# EAGLE schematic R3D2_v2 (EAGLE 6.4)
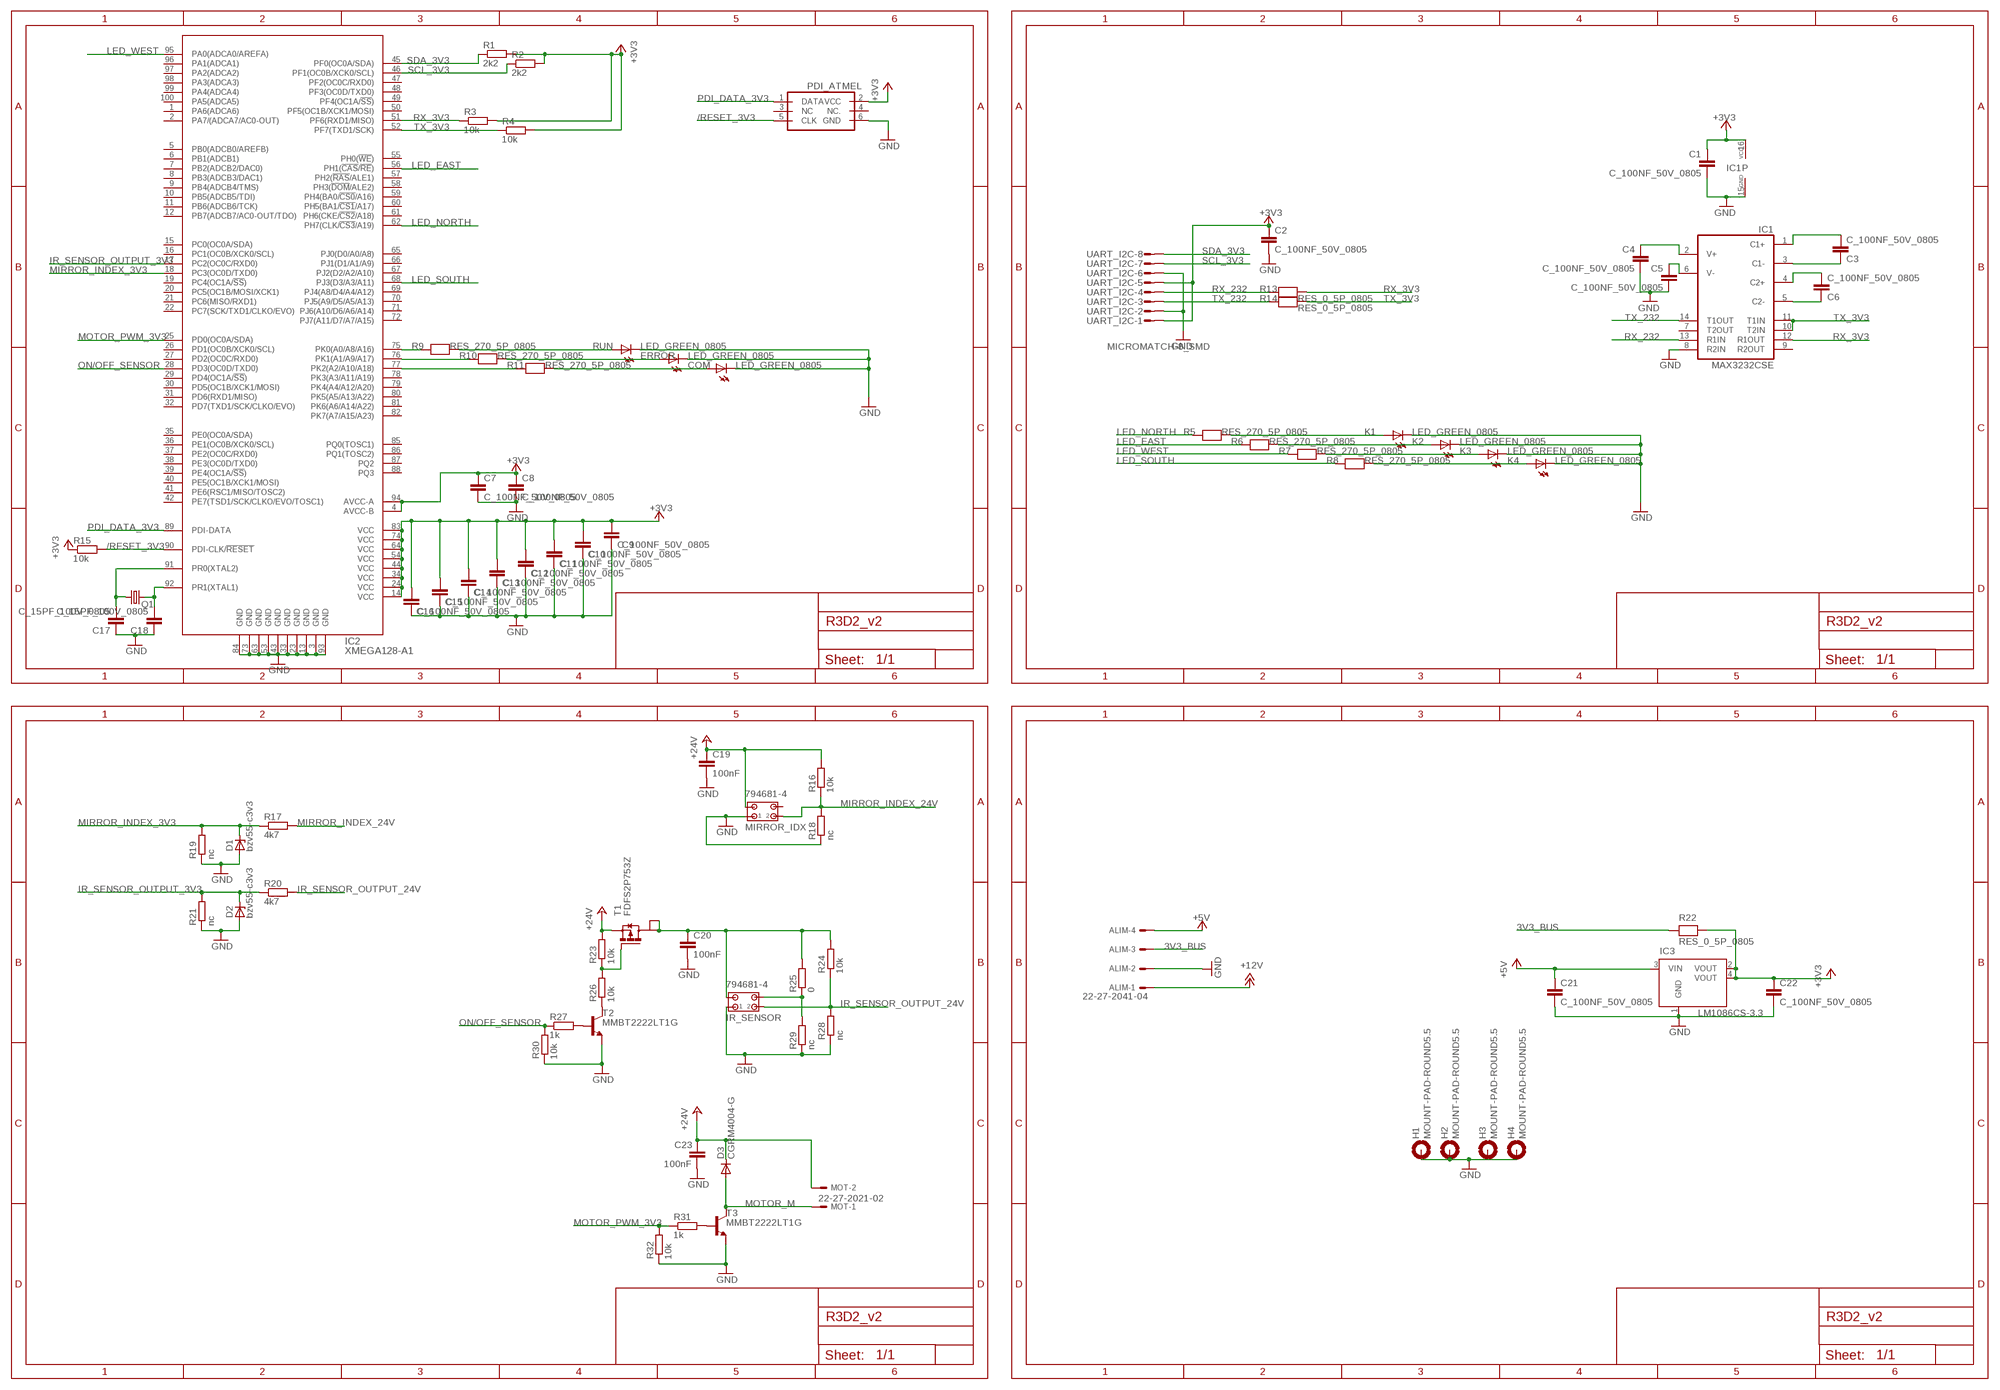
[diagram p0: schematic, sheet 1]

## Parts
ALIM  22-27-2041-04  [6410-04]
C1  C_100NF_50V_0805  [C0805]
C2  C_100NF_50V_0805  [C0805]
C3  C_100NF_50V_0805  [C0805]
C4  C_100NF_50V_0805  [C0805]
C5  C_100NF_50V_0805  [C0805]
C6  C_100NF_50V_0805  [C0805]
C7  C_100NF_50V_0805  [C0805]
C8  C_100NF_50V_0805  [C0805]
C9  C_100NF_50V_0805  [C0805]
C10  C_100NF_50V_0805  [C0805]
C11  C_100NF_50V_0805  [C0805]
C12  C_100NF_50V_0805  [C0805]
C13  C_100NF_50V_0805  [C0805]
C14  C_100NF_50V_0805  [C0805]
C15  C_100NF_50V_0805  [C0805]
C16  C_100NF_50V_0805  [C0805]
C17  C_15PF_100V_0805  [C0805]
C18  C_15PF_100V_0805  [C0805]
C19  100nF  C-EUC0805  [C0805]
C20  100nF  C-EUC0603  [C0603]
C21  C_100NF_50V_0805  [C0805]
C22  C_100NF_50V_0805  [C0805]
C23  100nF  C-EUC0805  [C0805]
COM  LED_GREEN_0805  [CHIP-LED0805]
D1  bzv55-c3v3  ZENER-DIODESOD80C  [SOD80C]
D2  bzv55-c3v3  ZENER-DIODESOD80C  [SOD80C]
D3  CGRM4004-G  [SOD-123_MINI-SMA]
ERROR  LED_GREEN_0805  [CHIP-LED0805]
H1  MOUNT-PAD-ROUND5.5  [5,5-PAD]
H2  MOUNT-PAD-ROUND5.5  [5,5-PAD]
H3  MOUNT-PAD-ROUND5.5  [5,5-PAD]
H4  MOUNT-PAD-ROUND5.5  [5,5-PAD]
IC1  MAX3232CSE  [SO16]
IC2  XMEGA128-A1  XMEGA-A1TQFP  [TQFP100]
IC3  LM1086CS-3.3  [TO263]
IR_SENSOR  794681-4  [794681-4]
K1  LED_GREEN_0805  [CHIP-LED0805]
K2  LED_GREEN_0805  [CHIP-LED0805]
K3  LED_GREEN_0805  [CHIP-LED0805]
K4  LED_GREEN_0805  [CHIP-LED0805]
MIRROR_IDX  794681-4  [794681-4]
MOT  22-27-2021-02  [6410-02]
PDI_ATMEL  PDI_ATMEL  [ML6]
Q1  CRYSTAL_16MHZ_HC49UP  [HC49UP]
R1  2k2  R-EU_R0603  [R0603]
R2  2k2  R-EU_R0603  [R0603]
R3  10k  R-EU_R0603  [R0603]
R4  10k  R-EU_R0603  [R0603]
R5  RES_270_5P_0805  [R0805]
R6  RES_270_5P_0805  [R0805]
R7  RES_270_5P_0805  [R0805]
R8  RES_270_5P_0805  [R0805]
R9  RES_270_5P_0805  [R0805]
R10  RES_270_5P_0805  [R0805]
R11  RES_270_5P_0805  [R0805]
R13  RES_0_5P_0805  [R0805]
R14  RES_0_5P_0805  [R0805]
R15  10k  R-EU_R0603  [R0603]
R16  10k  R-EU_R0603  [R0603]
R17  4k7  R-EU_R0805  [R0805]
R18  nc  R-EU_R0805  [R0805]
R19  nc  R-EU_R0603  [R0603]
R20  4k7  R-EU_R0805  [R0805]
R21  nc  R-EU_R0603  [R0603]
R22  RES_0_5P_0805  [R0805]
R23  10k  R-EU_R0603  [R0603]
R24  10k  R-EU_R0603  [R0603]
R25  0  R-EU_R0603  [R0603]
R26  10k  R-EU_R0603  [R0603]
R27  1k  R-EU_R0603  [R0603]
R28  nc  R-EU_R0603  [R0603]
R29  nc  R-EU_R0603  [R0603]
R30  10k  R-EU_R0603  [R0603]
R31  1k  R-EU_R0603  [R0603]
R32  10k  R-EU_R0603  [R0603]
RUN  LED_GREEN_0805  [CHIP-LED0805]
T1  FDFS2P753Z  [SO8]
T2  MMBT2222LT1G  MMBT2222ALT1-NPN-SOT23-BEC  [SOT23-BEC]
T3  MMBT2222LT1G  MMBT2222ALT1-NPN-SOT23-BEC  [SOT23-BEC]
UART_I2C  MICROMATCH-8_SMD  [MICROMATCH-8_SMD]

## Nets
3V3_BUS: ALIM.3 R22.1
+3V3: C1.1 C2.1 C7.1 C8.1 C9.1 C10.1 C11.1 C12.1 C13.1 C14.1 C15.1 C16.1 C22.1 IC1.16(VCC) IC2.4(AVCC-B) IC2.14(VCC) IC2.24(VCC) IC2.34(VCC) IC2.44(VCC) IC2.54(VCC) IC2.64(VCC) IC2.74(VCC) IC2.83(VCC) IC2.94(AVCC-A) IC3.2(VOUT) IC3.4(VOUT) PDI_ATMEL.2(VCC) R1.2 R2.2 R3.2 R4.2 R15.1 R22.2 UART_I2C.1 UART_I2C.5
+5V: ALIM.4 C21.1 IC3.3(VIN)
+12V: ALIM.1
+24V: C19.1 C23.1 D3.C MIRROR_IDX.3 MOT.2 R16.2 R23.2 T1.3(S)
/RESET_3V3: IC2.90(PDI-CLK/!RESET) PDI_ATMEL.5(CLK) R15.2
GND: ALIM.2 C1.2 C2.2 C4.2 C5.2 C7.2 C8.2 C9.2 C10.2 C11.2 C12.2 C13.2 C14.2 C15.2 C16.2 C17.1 C18.1 C19.2 C20.2 C21.2 C22.2 C23.2 COM.C D1.A D2.A ERROR.C H1.B5,5(MOUNT) H2.B5,5(MOUNT) H3.B5,5(MOUNT) H4.B5,5(MOUNT) IC1.8(R2IN) IC1.15(GND) IC2.3(GND) IC2.13(GND) IC2.23(GND) IC2.33(GND) IC2.43(GND) IC2.53(GND) IC2.63(GND) IC2.73(GND) IC2.84(GND) IC2.93(GND) IC3.1(GND) IR_SENSOR.1 K1.C K2.C K3.C K4.C MIRROR_IDX.1 PDI_ATMEL.6(GND) R18.1 R19.1 R21.1 R28.1 R29.1 R30.1 R32.1 RUN.C T2.E T3.E UART_I2C.2 UART_I2C.6
IR_SENSOR_OUTPUT_3V3: D2.C IC2.17(PC2(OC0C/RXD0)) R20.1 R21.2
IR_SENSOR_OUTPUT_24V: IR_SENSOR.2 R20.2 R24.1 R28.2
LED_EAST: IC2.56(PH1(!CAS!/!RE!)) R6.1
LED_NORTH: IC2.62(PH7(CLK/!CS3!/A19)) R5.1
LED_SOUTH: IC2.68(PJ3(D3/A3/A11)) R8.1
LED_WEST: IC2.95(PA0(ADCA0/AREFA)) R7.1
MIRROR_INDEX_3V3: D1.C IC2.18(PC3(OC0D/TXD0)) R17.1 R19.2
MIRROR_INDEX_24V: MIRROR_IDX.2 R16.1 R17.2 R18.2
MOTOR_M: D3.A MOT.1 T3.C
MOTOR_PWM_3V3: IC2.25(PD0(OC0A/SDA)) R31.1 R32.2
N$1: C3.1 IC1.1(C1+)
N$2: R9.2 RUN.A
N$3: R31.2 T3.B
N$4: ERROR.A R10.2
N$5: C3.2 IC1.3(C1-)
N$6: C6.1 IC1.4(C2+)
N$7: COM.A R11.2
N$9: IC2.75(PK0(A0/A8/A16)) R9.1
N$10: IC2.76(PK1(A1/A9/A17)) R10.1
N$11: C4.1 IC1.2(V+)
N$12: IC2.77(PK2(A2/A10/A18)) R11.1
N$13: C5.1 IC1.6(V-)
N$24: C6.2 IC1.5(C2-)
N$45: C17.2 IC2.91(PR0(XTAL2)) Q1.1
N$46: C18.2 IC2.92(PR1(XTAL1)) Q1.2
N$91: K1.A R5.2
N$92: K2.A R6.2
N$93: K3.A R7.2
N$94: K4.A R8.2
N$113: R27.2 T2.B
N$125: C20.1 IR_SENSOR.3 R24.2 R25.2 T1.5(D) T1.6(D1)
N$126: R26.1 T2.C
N$128: R23.1 R26.2 T1.4(G)
N$129: IR_SENSOR.4 R25.1 R29.2
ON/OFF_SENSOR: IC2.28(PD3(OC0D/TXD0)) R27.1 R30.2
PDI_DATA_3V3: IC2.89(PDI-DATA) PDI_ATMEL.1(DATA)
RX_3V3: IC1.12(R1OUT) IC2.51(PF6(RXD1/MISO)) R3.1 R13.2
RX_232: IC1.13(R1IN) R13.1 UART_I2C.4
SCL_3V3: IC2.46(PF1(OC0B/XCK0/SCL)) R2.1 UART_I2C.7
SDA_3V3: IC2.45(PF0(OC0A/SDA)) R1.1 UART_I2C.8
TX_3V3: IC1.10(T2IN) IC1.11(T1IN) IC2.52(PF7(TXD1/SCK)) R4.1 R14.2
TX_232: IC1.14(T1OUT) R14.1 UART_I2C.3
Unconnected: IC1.7(T2OUT) IC1.9(R2OUT) IC2.1(PA6(ADCA6)) IC2.2(PA7/(ADCA7/AC0-OUT)) IC2.5(PB0(ADCB0/AREFB)) IC2.6(PB1(ADCB1)) IC2.7(PB2(ADCB2/DAC0)) IC2.8(PB3(ADCB3/DAC1)) IC2.9(PB4(ADCB4/TMS)) IC2.10(PB5(ADCB5/TDI)) IC2.11(PB6(ADCB6/TCK)) IC2.12(PB7(ADCB7/AC0-OUT/TDO)) IC2.15(PC0(OC0A/SDA)) IC2.16(PC1(OC0B/XCK0/SCL)) IC2.19(PC4(OC1A/!SS!)) IC2.20(PC5(OC1B/MOSI/XCK1)) IC2.21(PC6(MISO/RXD1)) IC2.22(PC7(SCK/TXD1/CLKO/EVO)) IC2.26(PD1(OC0B/XCK0/SCL)) IC2.27(PD2(OC0C/RXD0)) IC2.29(PD4(OC1A/!SS!)) IC2.30(PD5(OC1B/XCK1/MOSI)) IC2.31(PD6(RXD1/MISO)) IC2.32(PD7(TXD1/SCK/CLKO/EVO)) IC2.35(PE0(OC0A/SDA)) IC2.36(PE1(OC0B/XCK0/SCL)) IC2.37(PE2(OC0C/RXD0)) IC2.38(PE3(OC0D/TXD0)) IC2.39(PE4(OC1A/!SS!)) IC2.40(PE5(OC1B/XCK1/MOSI)) IC2.41(PE6(RSC1/MISO/TOSC2)) IC2.42(PE7(TSD1/SCK/CLKO/EVO/TOSC1)) IC2.47(PF2(OC0C/RXD0)) IC2.48(PF3(OC0D/TXD0)) IC2.49(PF4(OC1A/!SS!)) IC2.50(PF5(OC1B/XCK1/MOSI)) IC2.55(PH0(!WE!)) IC2.57(PH2(!RAS!/ALE1)) IC2.58(PH3(!DOM!/ALE2)) IC2.59(PH4(BA0/!CS0!/A16)) IC2.60(PH5(BA1/!CS1!/A17)) IC2.61(PH6(CKE/!CS2!/A18)) IC2.65(PJ0(D0/A0/A8)) IC2.66(PJ1(D1/A1/A9)) IC2.67(PJ2(D2/A2/A10)) IC2.69(PJ4(A8/D4/A4/A12)) IC2.70(PJ5(A9/D5/A5/A13)) IC2.71(PJ6(A10/D6/A6/A14)) IC2.72(PJ7(A11/D7/A7/A15)) IC2.78(PK3(A3/A11/A19)) IC2.79(PK4(A4/A12/A20)) IC2.80(PK5(A5/A13/A22)) IC2.81(PK6(A6/A14/A22)) IC2.82(PK7(A7/A15/A23)) IC2.85(PQ0(TOSC1)) IC2.86(PQ1(TOSC2)) IC2.87(PQ2) IC2.88(PQ3) IC2.96(PA1(ADCA1)) IC2.97(PA2(ADCA2)) IC2.98(PA3(ADCA3)) IC2.99(PA4(ADCA4)) IC2.100(PA5(ADCA5)) MIRROR_IDX.4 PDI_ATMEL.3(NC) PDI_ATMEL.4(NC.)

## Library data of the parts
ALIM = con-molex:22-?-04: CONNECTOR wire to board 2.54 mm (.1 inch) pitch header
C1-C18 C21 C22 = robotter_capacitor:C_
C19 C20 C23 = rcl:C-EU: CAPACITOR, European symbol
COM ERROR K1-K4 RUN = robotter_diode:LED_
D1 D2 = diode:ZENER-DIODE: Z-Diode
D3 = diode:CGRM400*-G: Molded plasitc,JEDEC SOD-123/Mini SMA Source: Comchip CGRM4001-G.pdf
H1-H4 = holes:MOUNT-PAD-ROUND: MOUNTING PAD, round
IC1 = robotter_ic:MAX3232: True RS-232 Transceivers 3.0V to 5.5V, Low-Power up to 1Mbps, Using Four 0.1µF External Capacitors Source: http://pdfserv.maxim-ic.com/en/ds/MAX3222-MAX3241.pdf
IC2 = avr-7:XMEGA-A1: Atmel XMega A1 Series processor
IC3 = robotter_ic:LM1086CS-3.3
IR_SENSOR MIRROR_IDX = con-amp:794681-4: Micro MATE-N-LOK Connectors grid 1.5mm Dual Row Through Hole Vertical Metal Through Hole Holddowns Source: ENG_CD_794681_E.pdf
MOT = con-molex:22-?-02: CONNECTOR wire to board 2.54 mm (.1 inch) pitch header
PDI_ATMEL = robotter_connector:PDI_ATMEL: Ref Harting : 09 18 506 7323 Atmel pdi connector
Q1 = robotter_ic:CRYSTAL_: CRYSTAL
R1-R4 R15-R21 R23-R32 = rcl:R-EU_: RESISTOR, European symbol
R5-R11 R13 R14 R22 = robotter_resistor:RES_
T1 = robotter:FDFS2P753Z
T2 T3 = transistor-neu-to92:*-NPN-: NPN Transistror
UART_I2C = robotter_connector:MICROMATCH-8_SMD: Ref FN : 1865096